# Altium schematic sheet Mesanin.SchDoc
size A4; SheetNumber: 1; SheetTotal: 1
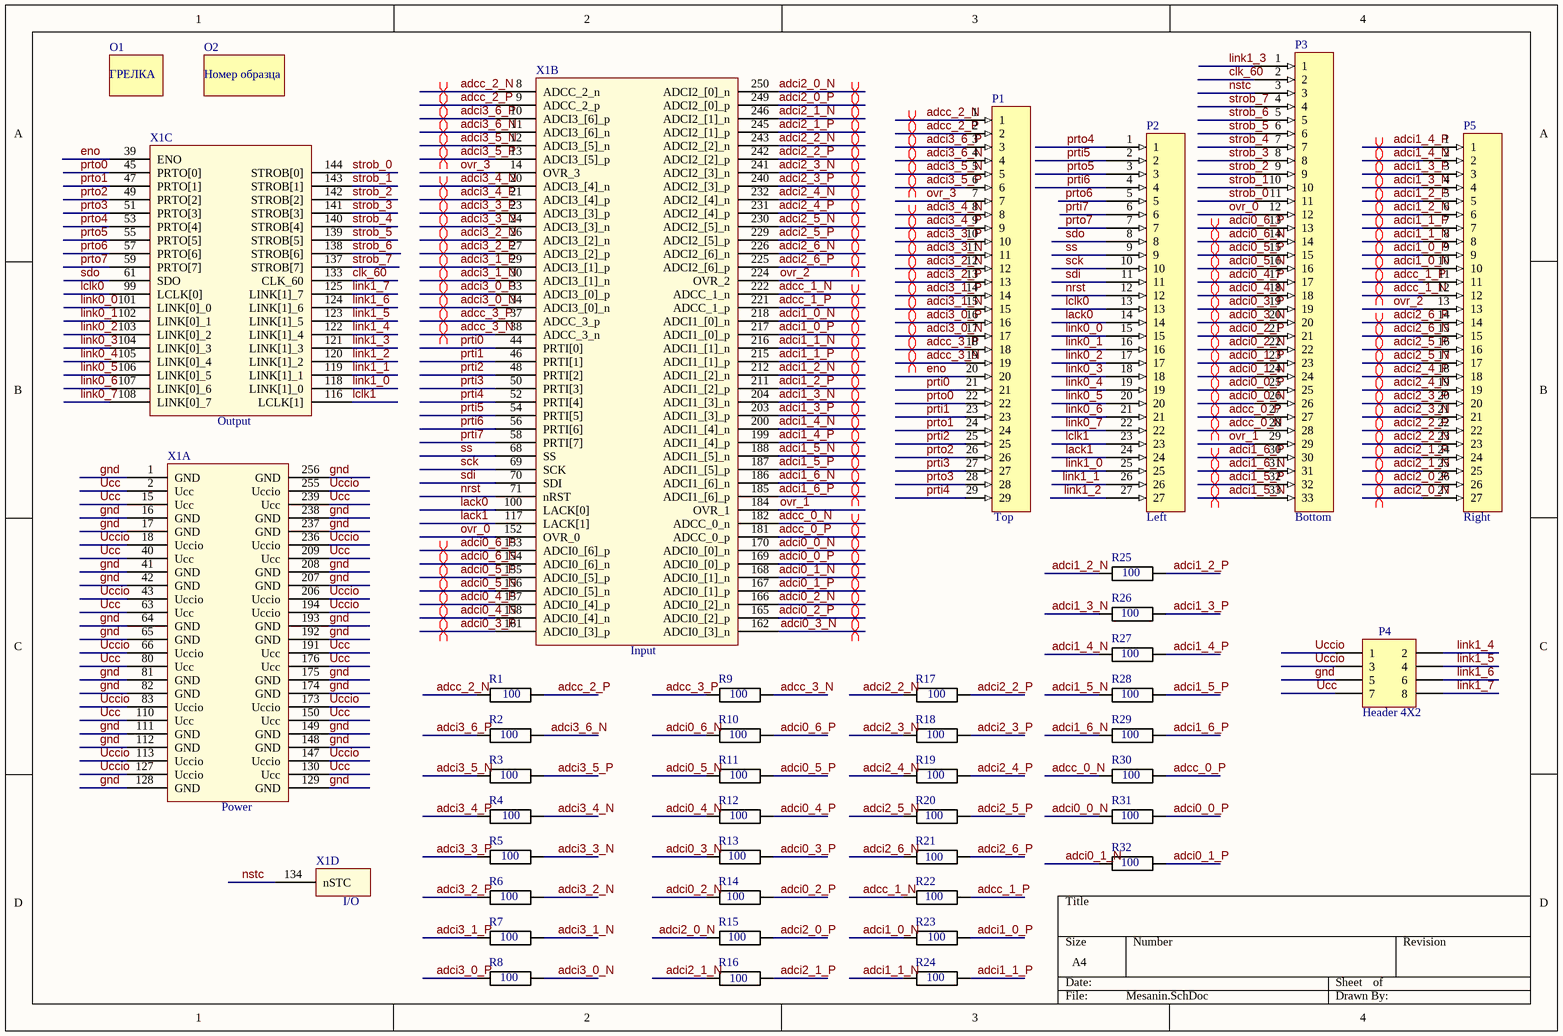
[diagram p0: Mesanin.SchDoc]

## Parts
O1  Грелка  [Грелка]  (value not drawn)
O2  Номер образца  [Номер образца]  (value not drawn)
P1  Top  [HEADER29]
P2  Left  [HEADER27]
P3  Bottom  [HEADER33]
P4  Header 4X2  [HDR2X4]
P5  Right  [HEADER27]
R1  100  [RES_0805]
R2  100  [RES_0805]
R3  100  [RES_0805]
R4  100  [RES_0805]
R5  100  [RES_0805]
R6  100  [RES_0805]
R7  100  [RES_0805]
R8  100  [RES_0805]
R9  100  [RES_0805]
R10  100  [RES_0805]
R11  100  [RES_0805]
R12  100  [RES_0805]
R13  100  [RES_0805]
R14  100  [RES_0805]
R15  100  [RES_0805]
R16  100  [RES_0805]
R17  100  [RES_0805]
R18  100  [RES_0805]
R19  100  [RES_0805]
R20  100  [RES_0805]
R21  100  [RES_0805]
R22  100  [RES_0805]
R23  100  [RES_0805]
R24  100  [RES_0805]
R25  100  [RES_0805]
R26  100  [RES_0805]
R27  100  [RES_0805]
R28  100  [RES_0805]
R29  100  [RES_0805]
R30  100  [RES_0805]
R31  100  [RES_0805]
R32  100  [RES_0805]
X1  5540TH01H4  [5540TH01H4]  (value not drawn)  (parts A,B,C,D of 4)

## Nets
adcc_0_N: P3.28 R30.1 X1.182(ADCC_0_n)
adcc_0_P: P3.27 R30.2 X1.181(ADCC_0_p)
adcc_1_N: P5.12 R22.1 X1.222(ADCC_1_n)
adcc_1_P: P5.11 R22.2 X1.221(ADCC_1_p)
adcc_2_N: P1.1 R1.1 X1.8(ADCC_2_n)
adcc_2_P: P1.2 R1.2 X1.9(ADCC_2_p)
adcc_3_N: P1.19 R9.2 X1.38(ADCC_3_n)
adcc_3_P: P1.18 R9.1 X1.37(ADCC_3_p)
adci0_0_N: P3.26 R31.1 X1.170(ADCI0_[0]_n)
adci0_0_P: P3.25 R31.2 X1.169(ADCI0_[0]_p)
adci0_1_N: P3.24 R32.1 X1.168(ADCI0_[1]_n)
adci0_1_P: P3.23 R32.2 X1.167(ADCI0_[1]_p)
adci0_2_N: P3.22 R14.1 X1.166(ADCI0_[2]_n)
adci0_2_P: P3.21 R14.2 X1.165(ADCI0_[2]_p)
adci0_3_N: P3.20 R13.1 X1.162(ADCI0_[3]_n)
adci0_3_P: P3.19 R13.2 X1.161(ADCI0_[3]_p)
adci0_4_N: P3.18 R12.1 X1.158(ADCI0_[4]_n)
adci0_4_P: P3.17 R12.2 X1.157(ADCI0_[4]_p)
adci0_5_N: P3.16 R11.1 X1.156(ADCI0_[5]_n)
adci0_5_P: P3.15 R11.2 X1.155(ADCI0_[5]_p)
adci0_6_N: P3.14 R10.1 X1.154(ADCI0_[6]_n)
adci0_6_P: P3.13 R10.2 X1.153(ADCI0_[6]_p)
adci1_0_N: P5.10 R23.1 X1.218(ADCI1_[0]_n)
adci1_0_P: P5.9 R23.2 X1.217(ADCI1_[0]_p)
adci1_1_N: P5.8 R24.1 X1.216(ADCI1_[1]_n)
adci1_1_P: P5.7 R24.2 X1.215(ADCI1_[1]_p)
adci1_2_N: P5.6 R25.1 X1.212(ADCI1_[2]_n)
adci1_2_P: P5.5 R25.2 X1.211(ADCI1_[2]_p)
adci1_3_N: P5.4 R26.1 X1.204(ADCI1_[3]_n)
adci1_3_P: P5.3 R26.2 X1.203(ADCI1_[3]_p)
adci1_4_N: P5.2 R27.1 X1.200(ADCI1_[4]_n)
adci1_4_P: P5.1 R27.2 X1.199(ADCI1_[4]_p)
adci1_5_N: P3.33 R28.1 X1.188(ADCI1_[5]_n)
adci1_5_P: P3.32 R28.2 X1.187(ADCI1_[5]_p)
adci1_6_N: P3.31 R29.1 X1.186(ADCI1_[6]_n)
adci1_6_P: P3.30 R29.2 X1.185(ADCI1_[6]_p)
adci2_0_N: P5.27 R15.1 X1.250(ADCI2_[0]_n)
adci2_0_P: P5.26 R15.2 X1.249(ADCI2_[0]_p)
adci2_1_N: P5.25 R16.1 X1.246(ADCI2_[1]_n)
adci2_1_P: P5.24 R16.2 X1.245(ADCI2_[1]_p)
adci2_2_N: P5.23 R17.1 X1.243(ADCI2_[2]_n)
adci2_2_P: P5.22 R17.2 X1.242(ADCI2_[2]_p)
adci2_3_N: P5.21 R18.1 X1.241(ADCI2_[3]_n)
adci2_3_P: P5.20 R18.2 X1.240(ADCI2_[3]_p)
adci2_4_N: P5.19 R19.1 X1.232(ADCI2_[4]_n)
adci2_4_P: P5.18 R19.2 X1.231(ADCI2_[4]_p)
adci2_5_N: P5.17 R20.1 X1.230(ADCI2_[5]_n)
adci2_5_P: P5.16 R20.2 X1.229(ADCI2_[5]_p)
adci2_6_N: P5.15 R21.1 X1.226(ADCI2_[6]_n)
adci2_6_P: P5.14 R21.2 X1.225(ADCI2_[6]_p)
adci3_0_N: P1.17 R8.2 X1.34(ADCI3_[0]_n)
adci3_0_P: P1.16 R8.1 X1.33(ADCI3_[0]_p)
adci3_1_N: P1.15 R7.2 X1.30(ADCI3_[1]_n)
adci3_1_P: P1.14 R7.1 X1.29(ADCI3_[1]_p)
adci3_2_N: P1.12 R6.2 X1.26(ADCI3_[2]_n)
adci3_2_P: P1.13 R6.1 X1.27(ADCI3_[2]_p)
adci3_3_N: P1.11 R5.2 X1.24(ADCI3_[3]_n)
adci3_3_P: P1.10 R5.1 X1.23(ADCI3_[3]_p)
adci3_4_N: P1.8 R4.2 X1.20(ADCI3_[4]_n)
adci3_4_P: P1.9 R4.1 X1.21(ADCI3_[4]_p)
adci3_5_N: P1.5 R3.1 X1.12(ADCI3_[5]_n)
adci3_5_P: P1.6 R3.2 X1.13(ADCI3_[5]_p)
adci3_6_N: P1.4 R2.2 X1.11(ADCI3_[6]_n)
adci3_6_P: P1.3 R2.1 X1.10(ADCI3_[6]_p)
clk_60: P3.2 X1.133(CLK_60)
eno: P1.20 X1.39(ENO)
gnd: P4.5 X1.1(GND) X1.16(GND) X1.17(GND) X1.41(GND) X1.42(GND) X1.64(GND) X1.65(GND) X1.81(GND) X1.82(GND) X1.111(GND) X1.112(GND) X1.128(GND) X1.129(GND) X1.148(GND) X1.149(GND) X1.174(GND) X1.175(GND) X1.192(GND) X1.193(GND) X1.207(GND) X1.208(GND) X1.237(GND) X1.238(GND) X1.256(GND)
lack0: P2.14 X1.100(LACK[0])
lack1: P2.24 X1.117(LACK[1])
lclk0: P2.13 X1.99(LCLK[0])
lclk1: P2.23 X1.116(LCLK[1])
link0_0: P2.15 X1.101(LINK[0]_0)
link0_1: P2.16 X1.102(LINK[0]_1)
link0_2: P2.17 X1.103(LINK[0]_2)
link0_3: P2.18 X1.104(LINK[0]_3)
link0_4: P2.19 X1.105(LINK[0]_4)
link0_5: P2.20 X1.106(LINK[0]_5)
link0_6: P2.21 X1.107(LINK[0]_6)
link0_7: P2.22 X1.108(LINK[0]_7)
link1_0: P2.25 X1.118(LINK[1]_0)
link1_1: P2.26 X1.119(LINK[1]_1)
link1_2: P2.27 X1.120(LINK[1]_2)
link1_3: P3.1 X1.121(LINK[1]_3)
link1_4: P4.2 X1.122(LINK[1]_4)
link1_5: P4.4 X1.123(LINK[1]_5)
link1_6: P4.6 X1.124(LINK[1]_6)
link1_7: P4.8 X1.125(LINK[1]_7)
nrst: P2.12 X1.71(nRST)
nstc: P3.3 X1.134(nSTC)
ovr_0: P3.12 X1.152(OVR_0)
ovr_1: P3.29 X1.184(OVR_1)
ovr_2: P5.13 X1.224(OVR_2)
ovr_3: P1.7 X1.14(OVR_3)
prti0: P1.21 X1.44(PRTI[0])
prti1: P1.23 X1.46(PRTI[1])
prti2: P1.25 X1.48(PRTI[2])
prti3: P1.27 X1.50(PRTI[3])
prti4: P1.29 X1.52(PRTI[4])
prti5: P2.2 X1.54(PRTI[5])
prti6: P2.4 X1.56(PRTI[6])
prti7: P2.6 X1.58(PRTI[7])
prto0: P1.22 X1.45(PRTO[0])
prto1: P1.24 X1.47(PRTO[1])
prto2: P1.26 X1.49(PRTO[2])
prto3: P1.28 X1.51(PRTO[3])
prto4: P2.1 X1.53(PRTO[4])
prto5: P2.3 X1.55(PRTO[5])
prto6: P2.5 X1.57(PRTO[6])
prto7: P2.7 X1.59(PRTO[7])
sck: P2.10 X1.69(SCK)
sdi: P2.11 X1.70(SDI)
sdo: P2.8 X1.61(SDO)
ss: P2.9 X1.68(SS)
strob_0: P3.11 X1.144(STROB[0])
strob_1: P3.10 X1.143(STROB[1])
strob_2: P3.9 X1.142(STROB[2])
strob_3: P3.8 X1.141(STROB[3])
strob_4: P3.7 X1.140(STROB[4])
strob_5: P3.6 X1.139(STROB[5])
strob_6: P3.5 X1.138(STROB[6])
strob_7: P3.4 X1.137(STROB[7])
Ucc: P4.7 X1.2(Ucc) X1.15(Ucc) X1.40(Ucc) X1.63(Ucc) X1.80(Ucc) X1.110(Ucc) X1.130(Ucc) X1.150(Ucc) X1.176(Ucc) X1.191(Ucc) X1.209(Ucc) X1.239(Ucc)
Uccio: P4.1 P4.3 X1.18(Uccio) X1.43(Uccio) X1.66(Uccio) X1.83(Uccio) X1.113(Uccio) X1.127(Uccio) X1.147(Uccio) X1.173(Uccio) X1.194(Uccio) X1.206(Uccio) X1.236(Uccio) X1.255(Uccio)

## Layout directives
differential pair: adcc_0_N, adcc_0_P, adcc_1_N, adcc_1_P, adcc_2_N, adcc_2_P, adcc_3_N, adcc_3_P, adci0_0_N, adci0_0_P, adci0_1_N, adci0_1_P, adci0_2_N, adci0_2_P, adci0_3_N, adci0_3_P, adci0_4_N, adci0_4_P, adci0_5_N, adci0_5_P, adci0_6_N, adci0_6_P, adci1_0_N, adci1_0_P, adci1_1_N, adci1_1_P, adci1_2_N, adci1_2_P, adci1_3_N, adci1_3_P, adci1_4_N, adci1_4_P, adci1_5_N, adci1_5_P, adci1_6_N, adci1_6_P, adci2_0_N, adci2_0_P, adci2_1_N, adci2_1_P, adci2_2_N, adci2_2_P, adci2_3_N, adci2_3_P, adci2_4_N, adci2_4_P, adci2_5_N, adci2_5_P, adci2_6_N, adci2_6_P, adci3_0_N, adci3_0_P, adci3_1_N, adci3_1_P, adci3_2_N, adci3_2_P, adci3_3_N, adci3_3_P, adci3_4_N, adci3_4_P, adci3_5_N, adci3_5_P, adci3_6_N, adci3_6_P

## Notes on the sheet
- (in symbol 5540TH01H4, part A) Power
- (in symbol 5540TH01H4, part B) Input
- (in symbol 5540TH01H4, part C) Output
- (in symbol 5540TH01H4, part D) I/O
- (in symbol Грелка) ГРЕЛКА

## Library data of the parts
P1 = HEADER29
P2 P5 = HEADER27
P3 = HEADER33
P4 = Header 4X2: Header, 4-Pin, Dual row; LatestRevisionDate: 17-Jul-2002; LatestRevisionNote: Re-released for DXP Platform.; Publisher: Altium Limited
R1-R32 = RES